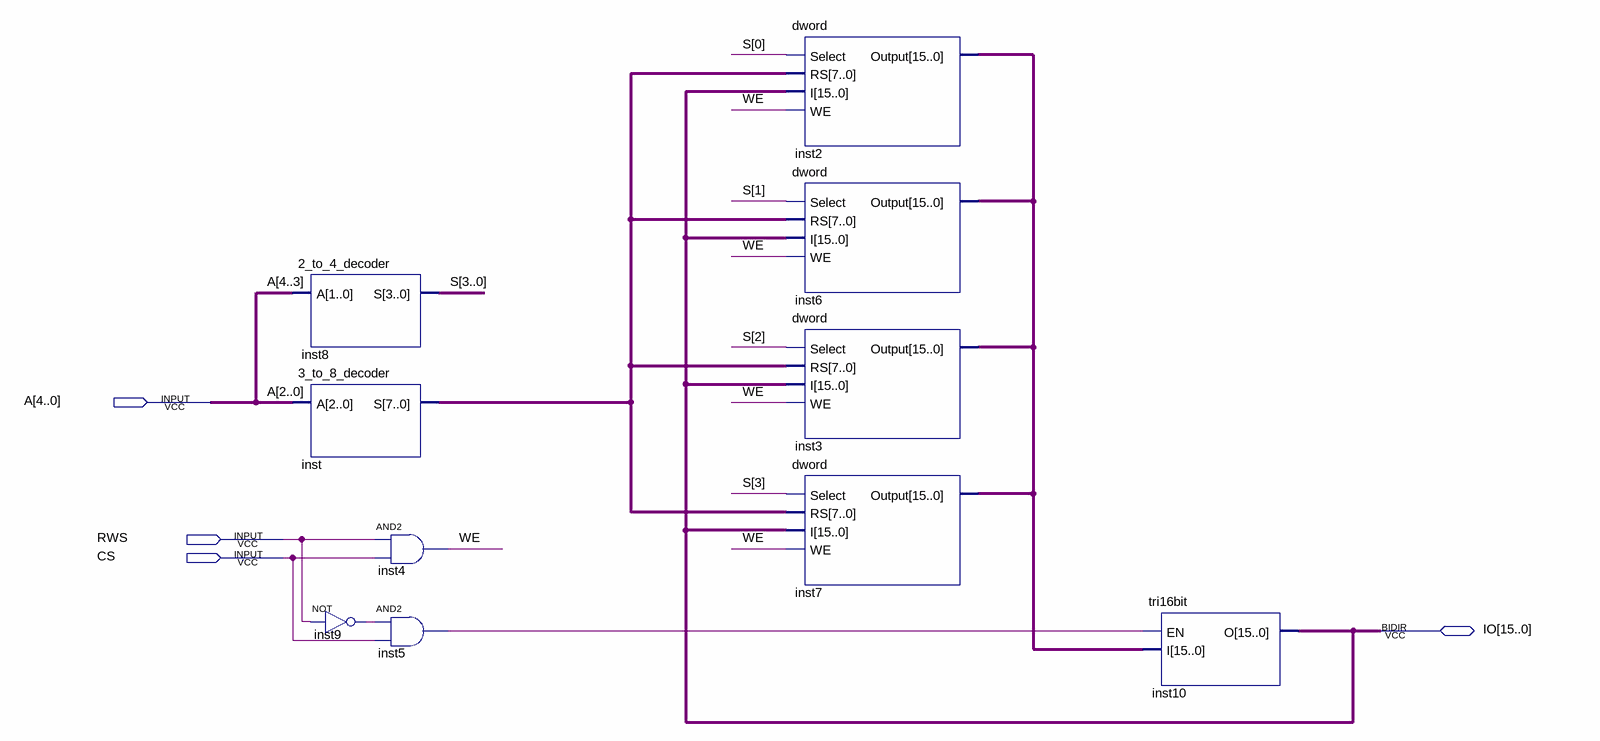
[diagram p0: schematic sheet]
// Quartus schematic DataMemory.bdf as structural Verilog: 10 symbols, 4 pins
module DataMemory (
  input  [4:0] A,
  input  RWS,
  input  CS,
  inout  [15:0] IO
);

  wire inst5_out, inst9_out, WE;
  wire [3:0] S;
  wire [7:0] inst_s;
  wire [15:0] inst2_output;

  \2_to_4_decoder  inst8 (.A(A[4:3]), .S(S));
  \3_to_8_decoder  inst (.A(A[2:0]), .S(inst_s));
  not inst9 (inst9_out, RWS);
  and inst4 (WE, RWS, CS);
  and inst5 (inst5_out, inst9_out, CS);
  dword inst2 (.Select(S[0]), .RS(inst_s), .I(IO), .WE(WE), .Output(inst2_output));
  dword inst6 (.Select(S[1]), .RS(inst_s), .I(IO), .WE(WE), .Output(inst2_output));
  dword inst3 (.Select(S[2]), .RS(inst_s), .I(IO), .WE(WE), .Output(inst2_output));
  dword inst7 (.Select(S[3]), .RS(inst_s), .I(IO), .WE(WE), .Output(inst2_output));
  tri16bit inst10 (.EN(inst5_out), .I(inst2_output), .O(IO));
endmodule
